# Altium schematic sheet DCCOMPProcess.SchDoc: DC Processing Section
size A4; CheckedBy: Ibrahim Khalid; Author: Ibrahim Khalid; CompanyName: Oscilly; DocumentNumber: Page 4 of 4; Revision: 1.0; SheetNumber: 4; SheetTotal: 4
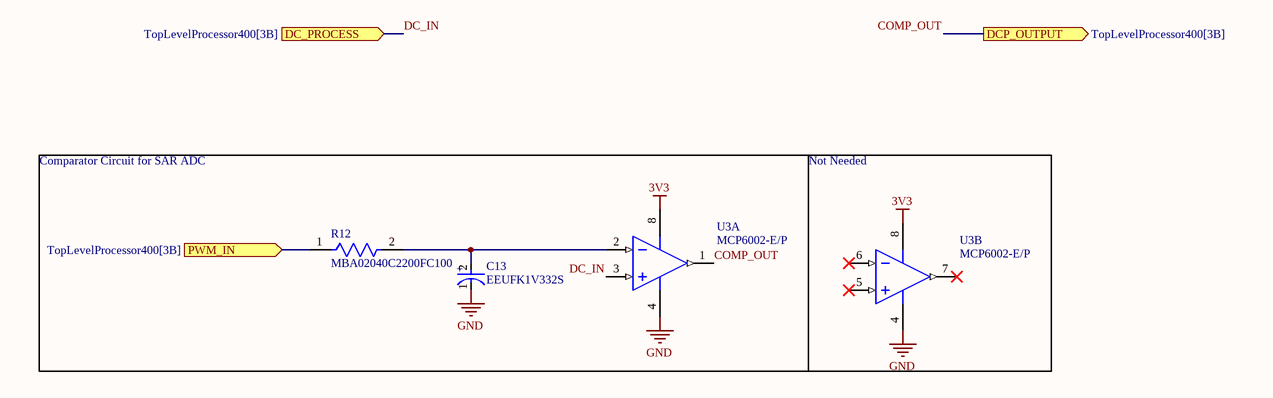
[diagram p0: DCCOMPProcess.SchDoc]

## Parts
C13  EEUFK1V332S  [FP-RAD-TH-D_18_0_5-L_25_2-MFG]
R12  MBA02040C2200FC100  [FP-MBA0204-MFG]
U3  MCP6002-E/P  [PDIP300-P8]  (parts A,B of 2)

## Blocks framed on the sheet
Comparator Circuit for SAR ADC: C13 R12 U3

## Ports
DC_PROCESS (in, see TopLevelProcessor400[3B]), DCP_OUTPUT (out, see TopLevelProcessor400[3B]), PWM_IN (in, see TopLevelProcessor400[3B])

## Nets
3V3: U3.8(VDD)
GND: C13.1(C) U3.4(VSS)
COMP_OUT: U3.1(VOUTA) ; port DCP_OUTPUT
DC_IN: U3.3(VINA+) ; port DC_PROCESS
PWM_IN: R12.1 ; port PWM_IN
NetC13_2: C13.2(A) R12.2 U3.2(VINA-)

Not connected (* = marked no-connect by the designer): U3 5(VINB+)* 6(VINB-)* 7(VOUTB)*

## Notes on the sheet
- Not Needed
- (in symbol CMP-05427-000163-1) +

## Library data of the parts
C13 = CMP-05427-000163-1: Aluminum Electrolytic Capacitors (Radial Lead Type) AEC-Q200 Qualified 3300uF ±20% 35V; Lead Diameter: 0.8mm; Capacitance: 3.3mF; Ripple Current: 2.85A; Life (Hours): 5000Hour; Dielectric Material: Aluminium; Termination: Radial; Length: 25mm; Max Operating Temperature: 105°C; Number of Pins: 2; Voltage Rating: 35V; RoHS Compliant: Yes; REACH SVHC: No SVHC; Series: FK; Min Operating Temperature: -55°C; Voltage: 35V; Voltage Rating (DC): 35V; Packaging: Bulk; Height: 25mm; Lead Pitch: 7.5mm; Case/Package: Radial; Diameter: 18mm; Package Quantity: 50; Radiation Hardening: No; Construction: RADIAL; Tolerance: 20%; Mount: Through Hole
R12 = CMP-02408-000005-1: RES 220 OHM 0.4W 1% AXIAL; Manufacturer: Vishay BC Components; Automotive Grade: Grade 1; Value: 220Ω; Voltage Rating: 200V; Temperature Coefficient: 50ppm/°C; Power Rating: 0.25W; Digikey Description: RES 220 OHM 0.4W 1% AXIAL; Height: 1.6mm; Automotive: Yes; Lead Free: Yes; Mouser Description: Thin Film Resistors - Through Hole .4watt 220ohms 1% 1/8watt body size; Temperature Range Low: -55°C; ComponentLink2Description: Datasheet; Temperature: -55°C to +125°C; Device Class L3: Through-Hole Resistors; Manufacturer Part Number: MBA02040C2200FC100; Ipc Land Pattern Name: RESAD500W65L360D160; Octopart: https://octopart.com/mba02040c2200fc100-vishay-43743094; Series: MBA/SMA 0204; RoHS: TRUE; Tolerance: 1%; Package: MBA0204; Device Class L1: Passive Components; ComponentLink2URL: http://www.vishay.com/docs/28766/mbxsma.pdf; Category: Res; Composition: Metal Film; Device Class L2: Resistors; Temperature Range High: +125°C; Resistance: 220Ω
U3 = CMP-0187-00133-3: None; Slew Rate: 0.6V/µs; Supply Current: 100uA; Power Supply Rejection Ratio (PSRR): 86dB; Input Offset Voltage (Vos): 4.5mV; Input Bias Current: 1pA; Amplifier Type: GENERAL PURPOSE; Unity Gain Bandwidth Product: 1MHz; Number of Circuits: 2; Output Current: 23mA; Operating Supply Voltage: 5.5V; Min Supply Voltage: 1.8V; Common Mode Rejection Ratio: 60dB; Voltage Gain: 112dB; Max Supply Voltage: 6V; Package Quantity: 60; REACH SVHC: No SVHC; Min Operating Temperature: -40°C; Max Operating Temperature: 125°C; Mount: Through Hole; Nominal Supply Current: 100uA; Height: 3.3mm; Length: 9.27mm; Slew Rate-Nom: 0.6V/µs; Packaging: Rail/Tube; Output Current per Channel: 23mA; Number of Amplifiers: 2; RoHS Compliant: Yes; Radiation Hardening: No; Bandwidth: 1MHz; Lead Free: Lead Free; Width: 6.35mm; Number of Channels: 2; Gain Bandwidth Product: 1MHz; Technology: CMOS; Operating Supply Current: 100uA; Number of Elements: 2; Number of Pins: 8; Input Offset Voltage-Max: 4.5mV; Case/Package: PDIP